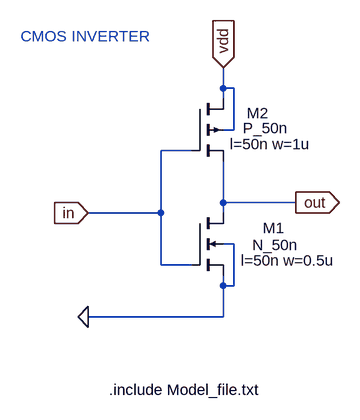
[diagram p0: schematic inverter.asc]
inverter.asc, the LTspice schematic file:
Version 4
SHEET 1 880 680
WIRE 240 -80 240 -112
WIRE 256 -80 240 -80
WIRE 240 -64 240 -80
WIRE 256 -16 256 -80
WIRE 256 -16 240 -16
WIRE 192 16 144 16
WIRE 240 96 240 32
WIRE 352 96 240 96
WIRE 144 112 144 16
WIRE 144 112 32 112
WIRE 240 112 240 96
WIRE 256 160 240 160
WIRE 144 192 144 112
WIRE 192 192 144 192
WIRE 240 224 240 208
WIRE 256 224 256 160
WIRE 256 224 240 224
WIRE 240 272 240 224
WIRE 240 272 32 272
FLAG 240 -112 vdd
IOPIN 240 -112 In
FLAG 32 112 in
IOPIN 32 112 In
FLAG 352 96 out
IOPIN 352 96 Out
FLAG 32 272 0
SYMBOL nmos4 192 112 R0
WINDOW 0 109 23 Left 2
WINDOW 3 93 49 Left 2
WINDOW 123 75 73 Left 2
SYMATTR InstName M1
SYMATTR Value N_50n
SYMATTR Value2 l=50n w=0.5u
SYMBOL pmos4 192 -64 R0
WINDOW 0 84 22 Left 2
WINDOW 3 78 45 Left 2
WINDOW 123 58 70 Left 2
SYMATTR InstName M2
SYMATTR Value P_50n
SYMATTR Value2 l=50n w=1u
TEXT 64 384 Left 2 !.include Model_file.txt
TEXT -72 -160 Left 2 ;CMOS INVERTER

The netlist it stands for:
* inverter.asc
M1 out in 0 0 N_50n l=50n w=0.5u
M2 vdd in out vdd P_50n l=50n w=1u
.model NMOS NMOS
.model PMOS PMOS
.lib standard.mos
.include Model_file.txt
* CMOS INVERTER
.backanno
.end